# Altium project F.PrjPcb
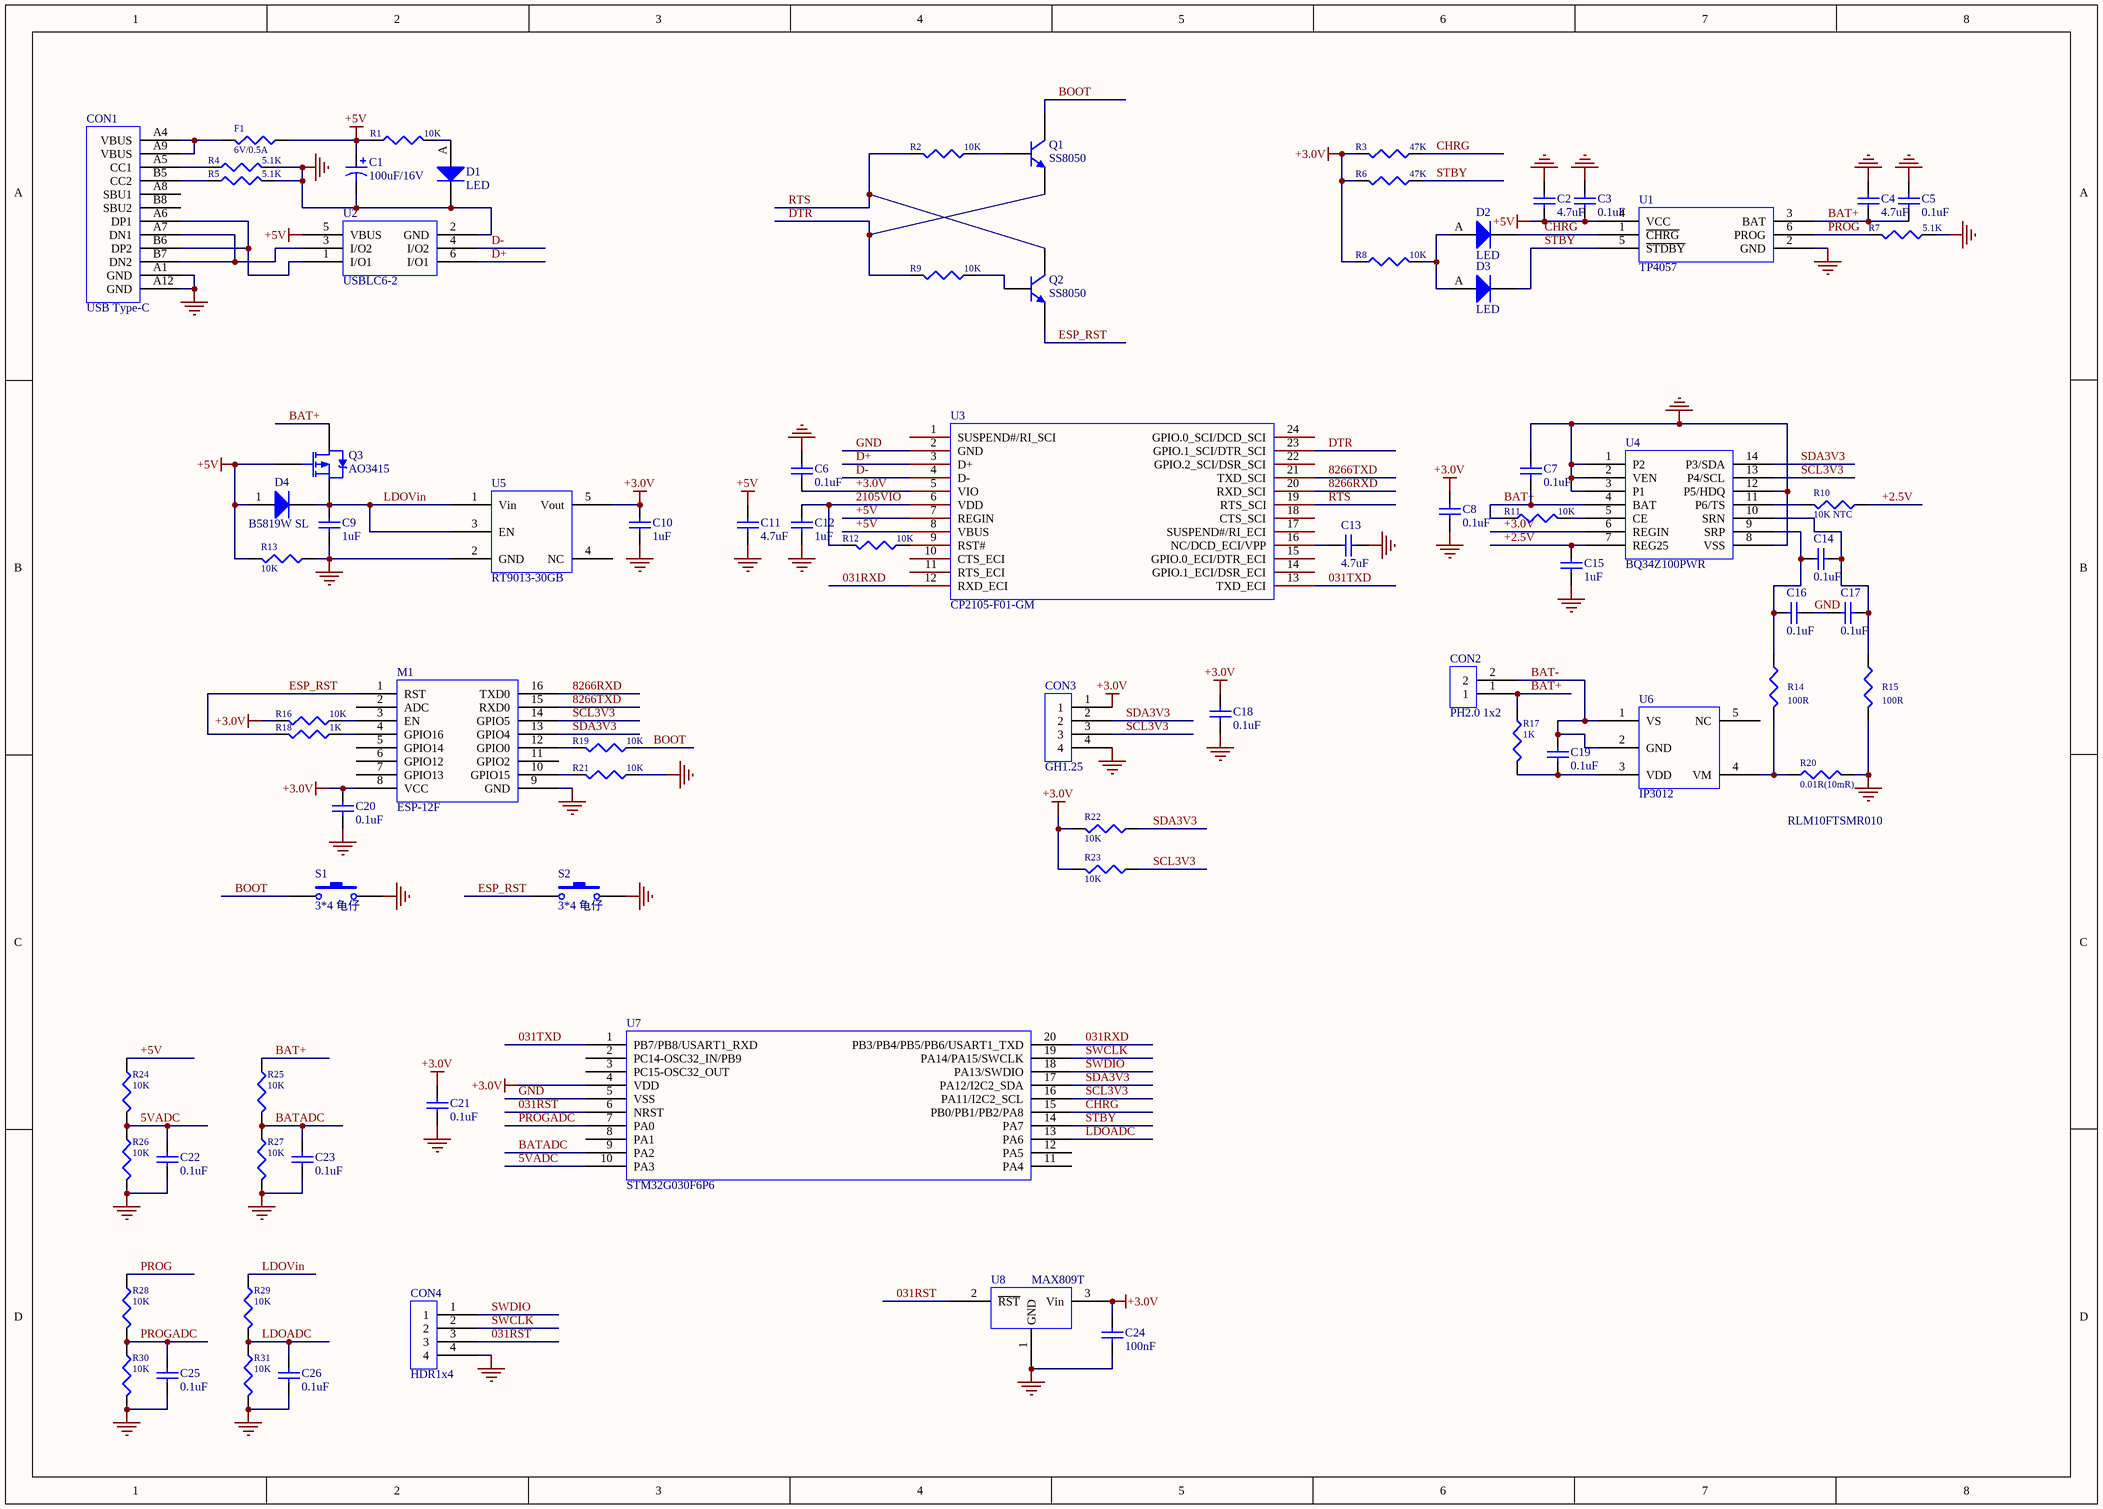
[diagram p0: F.SchDoc]
1 sheet, 80 parts. Net scope: global (net labels, ports and power ports of the same name join across sheets).
Board files: F.PcbDoc, PCB1.PcbDoc

## Sheet F.SchDoc
size A3; SheetNumber: 1; SheetTotal: 1

### Parts
C1  value 100uF/16V  [2312_6023-28_SMT-TAJ-C]  (hidden comment: Cap Pol1)
C2  4.7uF  [0603_C]
C3  0.1uF  [0402_C1]
C4  4.7uF  [0603_C]
C5  0.1uF  [0402_C1]
C6  0.1uF  [0402_C1]
C7  0.1uF  [0402_C1]
C8  0.1uF  [0402_C1]
C9  1uF  [0603_C]
C10  1uF  [0603_C]
C11  4.7uF  [0402_C1]
C12  1uF  [0402_C1]
C13  4.7uF  [0603_C]
C14  0.1uF  [0402_C1]
C15  1uF  [0402_C1]
C16  0.1uF  [0402_C1]
C17  0.1uF  [0402_C1]
C18  0.1uF  [0402_C1]
C19  0.1uF  [0402_C1]
C20  0.1uF  [0402_C1]
C21  0.1uF  [0402_C1]
C22  0.1uF  [0402_C1]
C23  0.1uF  [0402_C1]
C24  100nF  [0402_C1]
C25  0.1uF  [0402_C1]
C26  0.1uF  [0402_C1]
CON1  USB Type-C  [TYPE-C-SMD_HX-TYPE-C-16PIN]
CON2  PH2.0 1x2  [CONN-SMD_2P-P2.00_HDGC_HDGC2001WR-S-2P]
CON3  GH1.25  [GH1.25 4P 卧贴]
CON4  HDR1x4  [hdr1x4]
D1  LED  [0603_LED_S1]
D2  LED  [0603_LED_S1]
D3  LED  [0603_LED_S1]
D4  B5819W SL  [SOD-123_MARK]
F1  6V/0.5A  [0603_L]
M1  ESP-12F  [ESP_12]
Q1  SS8050  [SOT-23(SOT-23-3)]
Q2  SS8050  [SOT-23(SOT-23-3)]
Q3  AO3415  [SOT-23(SOT-23-3)]
R1  10K  [0402_r1]
R2  10K  [0402_r1]
R3  47K  [0402_R1]
R4  5.1K  [0402_r1]
R5  5.1K  [0402_r1]
R6  47K  [0402_R1]
R7  5.1K  [0402_r1]
R8  10K  [0402_r1]
R9  10K  [0402_r1]
R10  10K NTC  [0402_r1]
R11  10K  [0402_r1]
R12  10K  [0402_r1]
R13  10K  [0402_r1]
R14  100R  [0402_R1]
R15  100R  [0402_R1]
R16  10K  [0402_r1]
R17  1K  [0402_R1]
R18  1K  [0402_r1]
R19  10K  [0402_r1]
R20  0.01R(10mR)  [0805_R]
R21  10K  [0402_r1]
R22  10K  [0402_r1]
R23  10K  [0402_r1]
R24  10K  [0402_r1]
R25  10K  [0402_r1]
R26  10K  [0402_r1]
R27  10K  [0402_r1]
R28  10K  [0402_r1]
R29  10K  [0402_r1]
R30  10K  [0402_r1]
R31  10K  [0402_r1]
S1  3*4 龟仔  [3x4小龟]
S2  3*4 龟仔  [3x4小龟]
U1  TP4057  [SOT-23-6]
U2  USBLC6-2  [SOT-23-6]
U3  CP2105-F01-GM  [QFN50P400X400X80_HS-25N]
U4  BQ34Z100PWR  [TSSOP-14]
U5  RT9013-30GB  [SOT-23-5]
U6  IP3012  [SOT-23-5]
U7  STM32G030F6P6  [TSSOP-20]
U8  MAX809T  [SOT-23(SOT-23-3)]

### Nets
+3.0V: C6.1 C8.2 C10.2 C18.2 C20.2 C21.2 C24.1 CON3.1 M1.8(VCC) R3.1(TOP) R6.1(TOP) R8.2(BOT) R16.1(TOP) R22.2(BOT) R23.2(BOT) U3.5(VIO) U4.6(REGIN) U5.5(Vout) U7.4(VDD) U8.3(Vin)
+5V: C1.1 C2.1 C3.1 C11.2 D4.1(A) F1.2(BOT) Q3.1(G) R1.2(BOT) R13.1(TOP) R24.2(BOT) U1.4(VCC) U2.5(VBUS) U3.7(REGIN) U3.8(VBUS)
GND: C1.2 C2.2 C3.2 C4.2 C5.2 C6.2 C7.1 C8.1 C9.1 C10.1 C11.1 C12.1 C13.1 C15.1 C16.1 C17.2 C18.1 C20.1 C21.1 C22.1 C23.1 C24.2 C25.1 C26.1 CON1.A1(GND) CON1.A12(GND) CON3.4 CON4.4 D1.K M1.9(GND) R4.1(TOP) R5.1(TOP) R7.2(BOT) R13.2(BOT) R15.1(TOP) R20.1(TOP) R21.2(BOT) R26.1(TOP) R27.1(TOP) R30.1(TOP) R31.1(TOP) S1.2 S2.2 U1.2(GND) U2.2(GND) U3.2(GND) U4.1(P2) U4.2(VEN) U4.3(P1) U4.8(VSS) U4.12(P5/HDQ) U5.2(GND) U7.5(VSS) U8.1(GND)
5VADC: C22.2 R24.1(TOP) R26.2(BOT) U7.10(PA3)
031RST: CON4.3 U7.6(NRST) U8.2(~{RST})
031RXD: U3.12(RXD_ECI) U7.20(PB3/PB4/PB5/PB6/USART1_TXD)
031TXD: U3.13(TXD_ECI) U7.1(PB7/PB8/USART1_RXD)
2105VIO: C12.2 R12.1(TOP) U3.6(VDD)
8266RXD: M1.16(TXD0) U3.20(RXD_SCI)
8266TXD: M1.15(RXD0) U3.21(TXD_SCI)
+2.5V: C15.2 R10.1(TOP) U4.7(REG25)
BAT+: C4.1 C5.1 C7.2 CON2.1 Q3.3(D) R11.2(BOT) R17.2(BOT) R25.2(BOT) U1.3(BAT) U4.4(BAT)
BAT-: C19.2 CON2.2 U6.1(VS) U6.2(GND)
BATADC: C23.2 R25.1(TOP) R27.2(BOT) U7.9(PA2)
BOOT: Q1.3(C) R19.2(BOT) S1.1
CHRG: D2.K R3.2(BOT) U1.1(~{CHRG}) U7.15(PB0/PB1/PB2/PA8)
D+: U2.6(I/O1) U3.3(D+)
D-: U2.4(I/O2) U3.4(D-)
DTR: Q1.2(E) R9.1(TOP) U3.23(GPIO.1_SCI/DTR_SCI)
ESP_RST: M1.1(RST) Q2.2(E) R18.1(TOP) S2.1
LDOADC: C26.2 R29.1(TOP) R31.2(BOT) U7.13(PA6)
LDOVin: C9.2 D4.2(K) Q3.2(S) R29.2(BOT) U5.1(Vin) U5.3(EN)
PROG: R7.1(TOP) R28.2(BOT) U1.6(PROG)
PROGADC: C25.2 R28.1(TOP) R30.2(BOT) U7.7(PA0)
RTS: Q2.3(C) R2.1(TOP) U3.19(RTS_SCI)
SCL3V3: CON3.3 M1.14(GPIO5) R23.1(TOP) U4.13(P4/SCL) U7.16(PA11/I2C2_SCL)
SDA3V3: CON3.2 M1.13(GPIO4) R22.1(TOP) U4.14(P3/SDA) U7.17(PA12/I2C2_SDA)
STBY: D3.K R6.2(BOT) U1.5(~{ST}~{DBY}) U7.14(PA7)
SWCLK: CON4.2 U7.19(PA14/PA15/SWCLK)
SWDIO: CON4.1 U7.18(PA13/SWDIO)
NetC13_2: C13.2 U3.16(NC/DCD_ECI/VPP)
NetC14_1: C14.1 C17.1 R15.2(BOT) U4.10(SRN)
NetC14_2: C14.2 C16.2 R14.2(BOT) U4.9(SRP)
NetC19_1: C19.1 R17.1(TOP) U6.3(VDD)
NetCON1_A4: CON1.A4(VBUS) CON1.A9(VBUS) F1.1(TOP)
NetCON1_A5: CON1.A5(CC1) R4.2(BOT)
NetCON1_A6: CON1.A6(DP1) CON1.B6(DP2) U2.1(I/O1)
NetCON1_A7: CON1.A7(DN1) CON1.B7(DN2) U2.3(I/O2)
NetCON1_B5: CON1.B5(CC2) R5.2(BOT)
NetD1_A: D1.A R1.1(TOP)
NetD2_A: D2.A D3.A R8.1(TOP)
NetM1_3: M1.3(EN) R16.2(BOT)
NetM1_4: M1.4(GPIO16) R18.2(BOT)
NetM1_10: M1.10(GPIO15) R21.1(TOP)
NetM1_12: M1.12(GPIO0) R19.1(TOP)
NetQ1_1: Q1.1(B) R2.2(BOT)
NetQ2_1: Q2.1(B) R9.2(BOT)
NetR10_2: R10.2(BOT) U4.11(P6/TS)
NetR11_1: R11.1(TOP) U4.5(CE)
NetR12_2: R12.2(BOT) U3.9(RST#)
NetR14_1: R14.1(TOP) R20.2(BOT) U6.4(VM)

Not connected (* = marked no-connect by the designer): CON1 A8(SBU1) B8(SBU2); M1 2(ADC) 5(GPIO14) 6(GPIO12) 7(GPIO13) 11(GPIO2); U3 1(SUSPEND#/RI_SCI) 10(CTS_ECI) 11(RTS_ECI) 14(GPIO.1_ECI/DSR_ECI) 15(GPIO.0_ECI/DTR_ECI) 17(SUSPEND#/RI_ECI) 18(CTS_SCI) 22(GPIO.2_SCI/DSR_SCI) 24(GPIO.0_SCI/DCD_SCI); U5 4(NC); U6 5(NC); U7 2(PC14-OSC32_IN/PB9) 3(PC15-OSC32_OUT) 8(PA1) 11(PA4) 12(PA5)

### Notes on the sheet
- (near R20) RLM10FTSMR010

### Library data of the parts
C1 = Cap Pol1: Polarized Capacitor (Radial); Published: 8-Jun-2000; LatestRevisionDate: 17-Jul-2002; LatestRevisionNote: Re-released for DXP Platform.; PackageReference: RB7.6-15; Publisher: Altium Limited; PackageDescription: Polarized Capacitor (Radial); 2 Leads
C2-C26 = 0603 100nF (104) 10% 50V: 贴片电容; ComponentLink1Description: 供应商链接; ComponentLink1URL: http://www.szlcsc.com/product/details_15331.html; Package: 0603; Supplier: LC; SuppliersPartNumber: C14663
CON2 = HDR1x2
CON3 = HDR1x4
D1-D4 = Diode: 二极管; Notepad: 1N4007 4007 编号C2464 已经停售, 使用新物料编号C95872; ComponentLink1Description: 供应商链接; ComponentLink1URL: http://www.szlcsc.com/product/details_2841.html; Package: SMA(DO-214AC); Supplier: LC; SuppliersPartNumber: C95872
F1 R1-R31 = RES: Resistor
Q1 Q2 = SS8050: NPN General Purpose Amplifier
Q3 = AO3415: P沟道,-20V,-4A,41mΩ@-4.5V
S1 S2 = SW-PB: Switch; Published: 24-Mar-1999; LatestRevisionDate: 17-Jul-2002; LatestRevisionNote: Re-released for DXP Platform.; PackageReference: SPST-2; Publisher: Altium Limited; PackageDescription: Switch; 2 Leads
U1 = TP4057: 500mA 线性锂离子电池充电器
U2 = USBLC6-2: Very low capacitance ESD protection
U5 = RT9013-3.3V
U6 = IP3012: 高精度内置 MOSFET 单节锂电池保护 IC
U8 = MAX809T: 3.08v